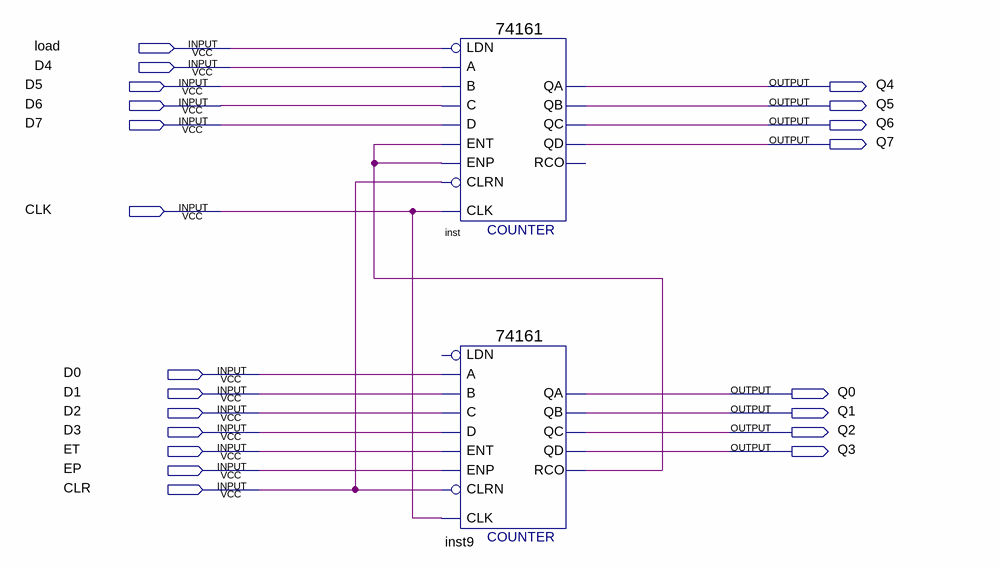
[diagram p0: schematic sheet]
// Quartus schematic TEST2.bdf as structural Verilog: 2 symbols, 21 pins
module TEST2 (
  input  load,
  input  D4,
  input  D5,
  input  D6,
  input  D7,
  input  CLK,
  input  D0,
  input  D1,
  input  D2,
  input  D3,
  input  ET,
  input  EP,
  input  CLR,
  output Q4,
  output Q5,
  output Q6,
  output Q7,
  output Q0,
  output Q1,
  output Q2,
  output Q3
);

  wire inst9_rco;

  \74161  inst (
    .CLRN(CLR), .CLK(CLK), .ENP(inst9_rco), .LDN(load), .A(D4), .D(D7), .ENT(inst9_rco), .B(D5), .C(D6),
    .QD(Q7), .QC(Q6), .QB(Q5), .QA(Q4));  // open: RCO
  \74161  inst9 (
    .CLRN(CLR), .CLK(CLK), .ENP(EP), .A(D0), .D(D3), .ENT(ET), .B(D1), .C(D2), .QD(Q3), .QC(Q2), .QB(Q1),
    .QA(Q0), .RCO(inst9_rco));  // open: LDN
endmodule
